# Altium schematic sheet Repeat(MPPT_charger,1, 2).SchDoc
size A3; SheetNumber: 3; SheetTotal: 7
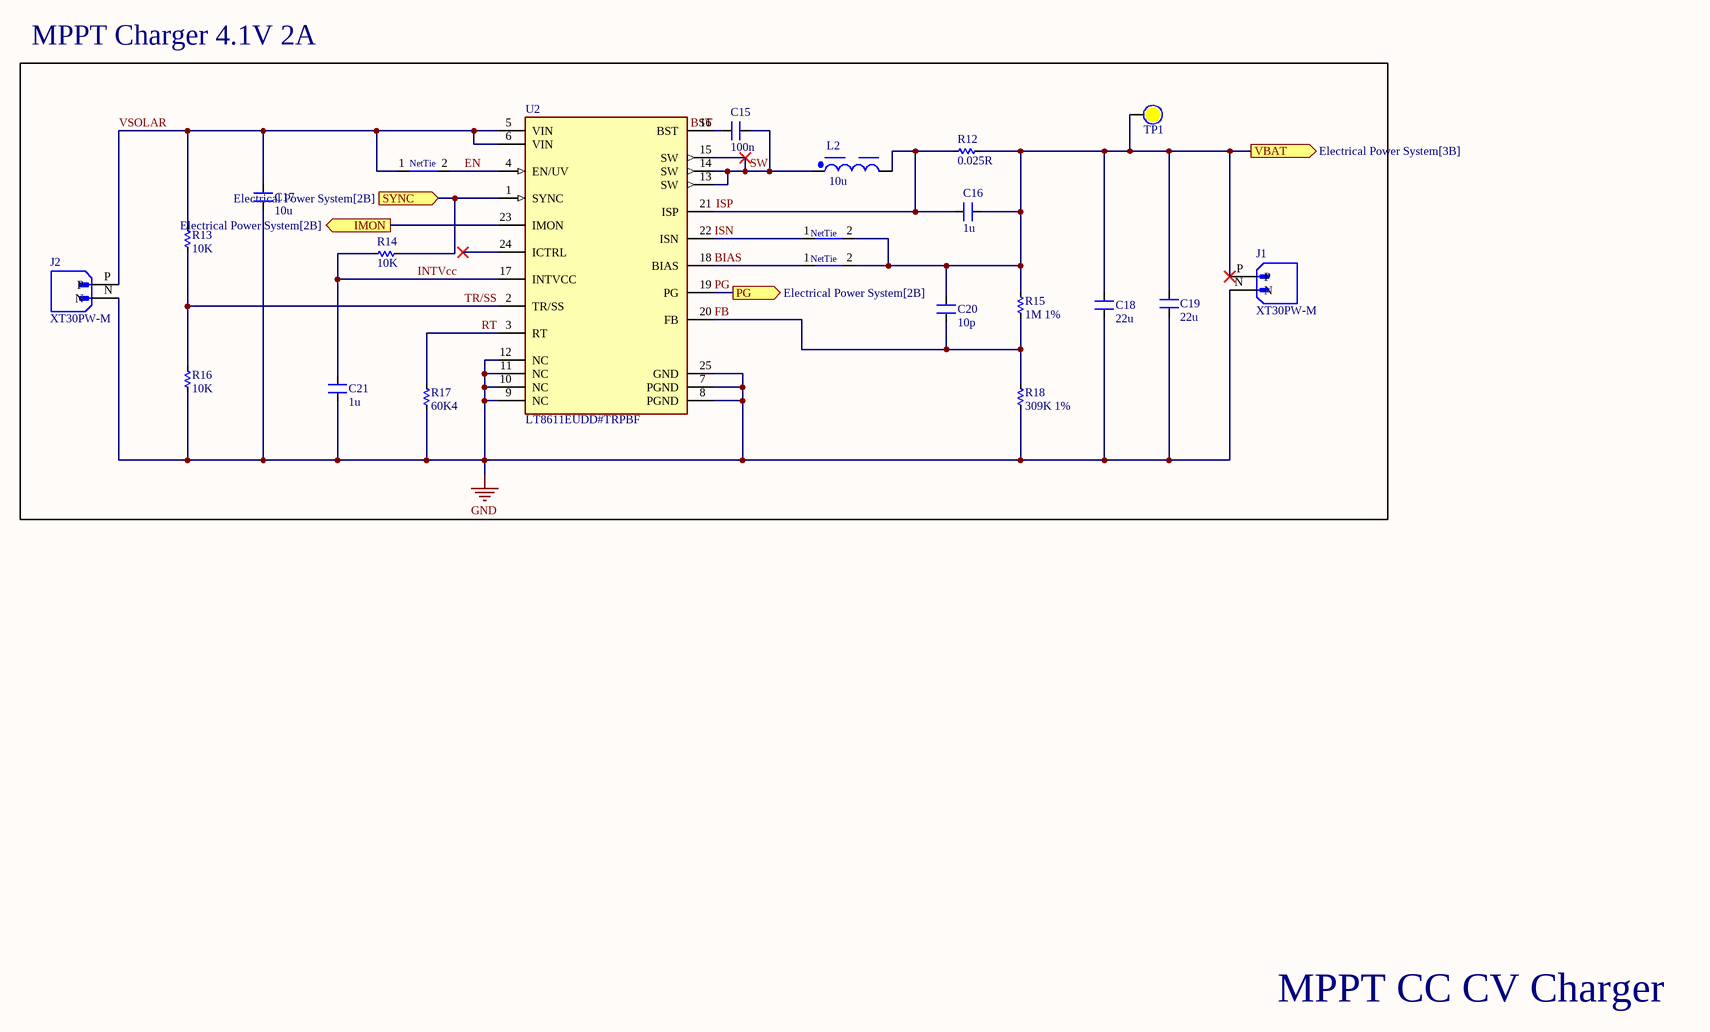
[diagram p0: Repeat(MPPT_charger,1, 2).SchDoc]

## Parts
C15  100n  [CN-SMD-0603]
C16  1u  [CN-SMD-0603]
C17  10u  [CN-SMD-1206]
C18  22u  [CN-SMD-1206]
C19  22u  [CN-SMD-1206]
C20  10p  [CN-SMD-0603]
C21  1u  [CN-SMD-0603]
J1  XT30PW-M  [AMASS_XT30PW-M]
J2  XT30PW-M  [AMASS_XT30PW-M]
L2  10u  [WE-PD_7345]
NT1  NetTie  [NETTIE_SMD]  (net tie, no BOM)
NT2  NetTie  [NETTIE_SMD]  (net tie, no BOM)
NT3  NetTie  [NETTIE_SMD]  (net tie, no BOM)
R12  0.025R  [RES-SMD-0805]
R13  10K  [RES-SMD-0805]
R14  10K  [RES-SMD-0805]
R15  1M 1%  [RES-SMD-0805]
R16  10K  [RES-SMD-0805]
R17  60K4  [RES-SMD-0805]
R18  309K 1%  [RES-SMD-0805]
TP1  TestPoint  [Test Point 1 MM]  (value not drawn)  (no BOM)
U2  LT8611EUDD#TRPBF  [FP-UDD-24-05-08-1833-IPC_B]

## Blocks framed on the sheet
MPPT Charger 4.1V 2A: C15-C21 J1 J2 L2 NT1-NT3 R12-R18 TP1 U2

## Ports
IMON (out, see Electrical Power System[2B]), PG (out, see Electrical Power System[2B]), SYNC (in, see Electrical Power System[2B]), VBAT (out, see Electrical Power System[3B])

## Nets
GND: C17.1 C18.1 C19.1 C21.1 J1.N J2.N R16.1 R17.1 R18.2 U2.7(PGND) U2.8(PGND) U2.9(NC) U2.10(NC) U2.11(NC) U2.12(NC) U2.25(GND)
BIAS: NT3.1 U2.18(BIAS)
BST: C15.2 U2.16(BST)
EN: NT1.2 U2.4(EN/UV)
FB: C20.1 R15.2 R18.1 U2.20(FB)
IMON: U2.23(IMON) ; port IMON
INTVcc: C21.2 R14.2 U2.17(INTVCC)
ISN: NT2.1 U2.22(ISN)
ISP: C16.2 L2.2 R12.2 U2.21(ISP)
PG: U2.19(PG) ; port PG
RT: R17.2 U2.3(RT)
SW: C15.1 L2.1 U2.13(SW) U2.14(SW) U2.15(SW)
SYNC: R14.1 U2.1(SYNC) ; port SYNC
TR/SS: R13.1 R16.2 U2.2(TR/SS)
VBAT: C16.1 C18.2 C19.2 C20.2 J1.P NT2.2 NT3.2 R12.1 R15.1 TP1.0 ; port VBAT
VSOLAR: C17.2 J2.P NT1.1 R13.2 U2.5(VIN) U2.6(VIN)

Not connected (* = marked no-connect by the designer): U2 24(ICTRL)*

## Notes on the sheet
- MPPT CC CV Charger

## Library data of the parts
C15-C21 = Capacitors: Value: 33pF
J1 J2 = XT30PW-M: Socket; DC supply; XT30; male; PIN: 2; on PCBs; THT; Colour: yellow; MF: AMASS; SnapEDA_Link: https://www.snapeda.com/parts/XT30PW-M/AMASS/view-part/?ref=snap; Package: None; Value: *; MP: XT30PW-M; Check_prices: https://www.snapeda.com/parts/XT30PW-M/AMASS/view-part/?ref=eda
L2 = CMP-0227-00113-2: NexarPartId: 11853718; Saturation Current: 2.6A; Current Rating: 2A; DC Resistance (DCR): 45mΩ; Inductance Tolerance: 20%; Core Material: Ferrite; Shielding: Shielded; Test Frequency: 1kHz; Inductance: 10µH; Self Resonant Frequency: 23MHz; RoHS: Compliant; Ambient Temperature Range Low: -40°C; Case/Package: Nonstandard; Composition: Wirewound; Height - Seated (Max): 4.4958mm; Mount: Surface Mount; Max DC Current: 2A; Length: 7.3mm; Termination: SMD/SMT; Depth: 7.3mm; Lead Pitch: 4mm; Ambient Temperature Range High: 85°C; Max Operating Temperature: 125°C; Width: 7.3mm; Lead Free: Lead Free; Min Operating Temperature: -40°C; Tolerance: 20%; Packaging: Cut Tape (CT); Number of Pins: 2; Height: 4.5mm
NT1-NT3 = NetTie_SMD: Net Tie SMD
R12-R18 = Res SMD: SMD; Manufacturer: Generic Components; Class: Passive; Published: 08/06/2000; Publisher: Altium Hobart Technology Centre
TP1 = Test Point: Solder: NF
U2 = CMP-0491-02169-2: IC REG BUCK ADJ 2.5A 24QFN; Synchronous Rectifier: Yes; Number of Outputs: 1; Output Type: Adjustable; Switching Frequency: 2MHz; Efficiency: 96%; Output Voltage: 40V; Max Operating Temperature: 125°C; Output Current: 2.5A; RoHS Compliant: Yes; Case/Package: QFN; Package Quantity: 2500; Lead Free: Lead Free; Series: -; Number of Pins: 24; Min Operating Temperature: -40°C; Packaging: Tape and Reel